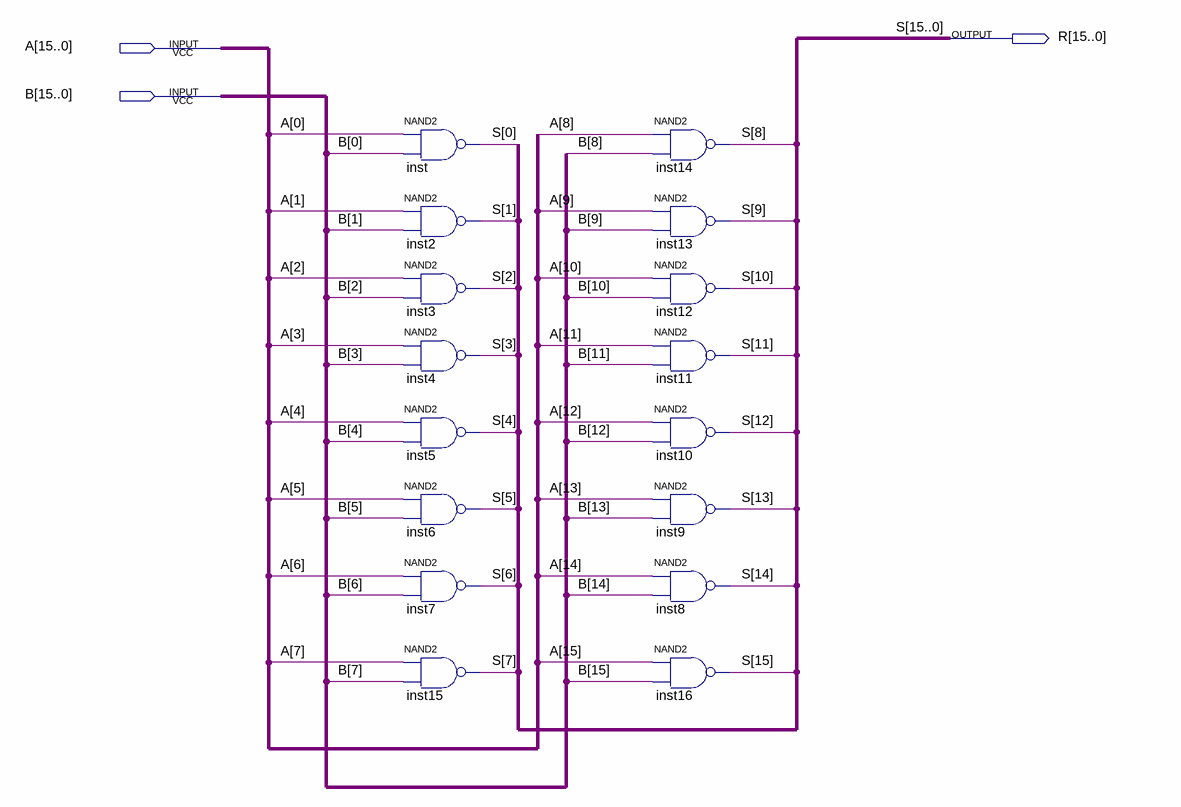
[diagram p0: schematic sheet]
// Quartus schematic NAND16BIT.bdf as structural Verilog: 16 symbols, 3 pins
module NAND16BIT (
  input  [15:0] A,
  input  [15:0] B,
  output [15:0] R
);

  nand inst (R[0], A[0], B[0]);
  nand inst2 (R[1], A[1], B[1]);
  nand inst3 (R[2], A[2], B[2]);
  nand inst4 (R[3], A[3], B[3]);
  nand inst5 (R[4], A[4], B[4]);
  nand inst6 (R[5], A[5], B[5]);
  nand inst7 (R[6], A[6], B[6]);
  nand inst15 (R[7], A[7], B[7]);
  nand inst14 (R[8], A[8], B[8]);
  nand inst13 (R[9], A[9], B[9]);
  nand inst12 (R[10], A[10], B[10]);
  nand inst11 (R[11], A[11], B[11]);
  nand inst10 (R[12], A[12], B[12]);
  nand inst9 (R[13], A[13], B[13]);
  nand inst8 (R[14], A[14], B[14]);
  nand inst16 (R[15], A[15], B[15]);

  // Other names for the same wires on the sheet: S[15:0] = R
endmodule
